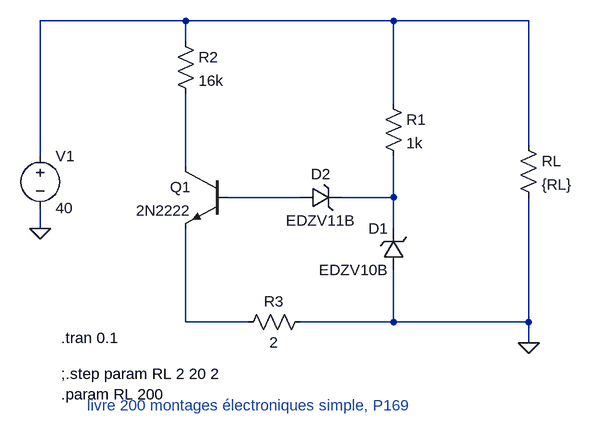
[diagram p0: schematic CurrentLimiter-02.asc]
CurrentLimiter-02.asc, the LTspice schematic file:
Version 4.1
SHEET 1 880 680
WIRE -32 -64 -256 -64
WIRE 288 -64 -32 -64
WIRE 496 -64 288 -64
WIRE -32 -32 -32 -64
WIRE 288 64 288 -64
WIRE 496 128 496 -64
WIRE -256 144 -256 -64
WIRE -32 160 -32 48
WIRE 144 208 32 208
WIRE 288 208 288 144
WIRE 288 208 208 208
WIRE -256 256 -256 224
WIRE 288 256 288 208
WIRE -32 400 -32 256
WIRE 64 400 -32 400
WIRE 288 400 288 320
WIRE 288 400 144 400
WIRE 496 400 496 208
WIRE 496 400 288 400
WIRE 496 432 496 400
FLAG -256 256 0
FLAG 496 432 0
SYMBOL zener 304 320 R180
WINDOW 0 24 64 Left 2
WINDOW 3 24 0 Left 2
SYMATTR InstName D1
SYMATTR Value EDZV10B
SYMBOL zener 144 224 R270
WINDOW 0 36 32 VTop 2
WINDOW 3 -4 32 VBottom 2
SYMATTR InstName D2
SYMATTR Value EDZV11B
SYMBOL res 272 48 R0
SYMATTR InstName R1
SYMATTR Value 1k
SYMBOL res -48 -48 R0
SYMATTR InstName R2
SYMATTR Value 16k
SYMBOL res 160 384 R90
WINDOW 0 0 56 VBottom 2
WINDOW 3 32 56 VTop 2
SYMATTR InstName R3
SYMATTR Value 2
SYMBOL npn 32 160 M0
SYMATTR InstName Q1
SYMATTR Value 2N2222
SYMBOL voltage -256 128 R0
WINDOW 123 0 0 Left 0
WINDOW 39 0 0 Left 0
SYMATTR InstName V1
SYMATTR Value 40
SYMBOL res 480 112 R0
SYMATTR InstName RL
SYMATTR Value {RL}
TEXT -224 480 Left 2 !;.step param RL 2 20 2\n.param RL 200
TEXT -224 424 Left 2 !.tran 0.1
TEXT -184 528 Left 2 ;livre 200 montages électroniques simple, P169

The netlist it stands for:
* CurrentLimiter-02.asc
D1 0 N004 EDZV10B
D2 N003 N004 EDZV11B
R1 N001 N004 1k
R2 N001 N002 16k
R3 0 N005 2
Q1 N002 N003 N005 0 2N2222
V1 N001 0 40
RL N001 0 {RL}
.model D D
.lib standard.dio
.model NPN NPN
.model PNP PNP
.lib standard.bjt
;.step param RL 2 20 2
.param RL 200
.tran 0.1
* livre 200 montages électroniques simple, P169
.backanno
.end